# Altium schematic sheet 11_Temp1.SchDoc: Misc
size A3; Organization: Lime Microsystems; Address1: Surrey Tech Centre; Address2: Guildford GU2 7YG; Address3: Surrey; Address4: United Kingdom; Revision: v1.1; SheetNumber: 10; SheetTotal: 10
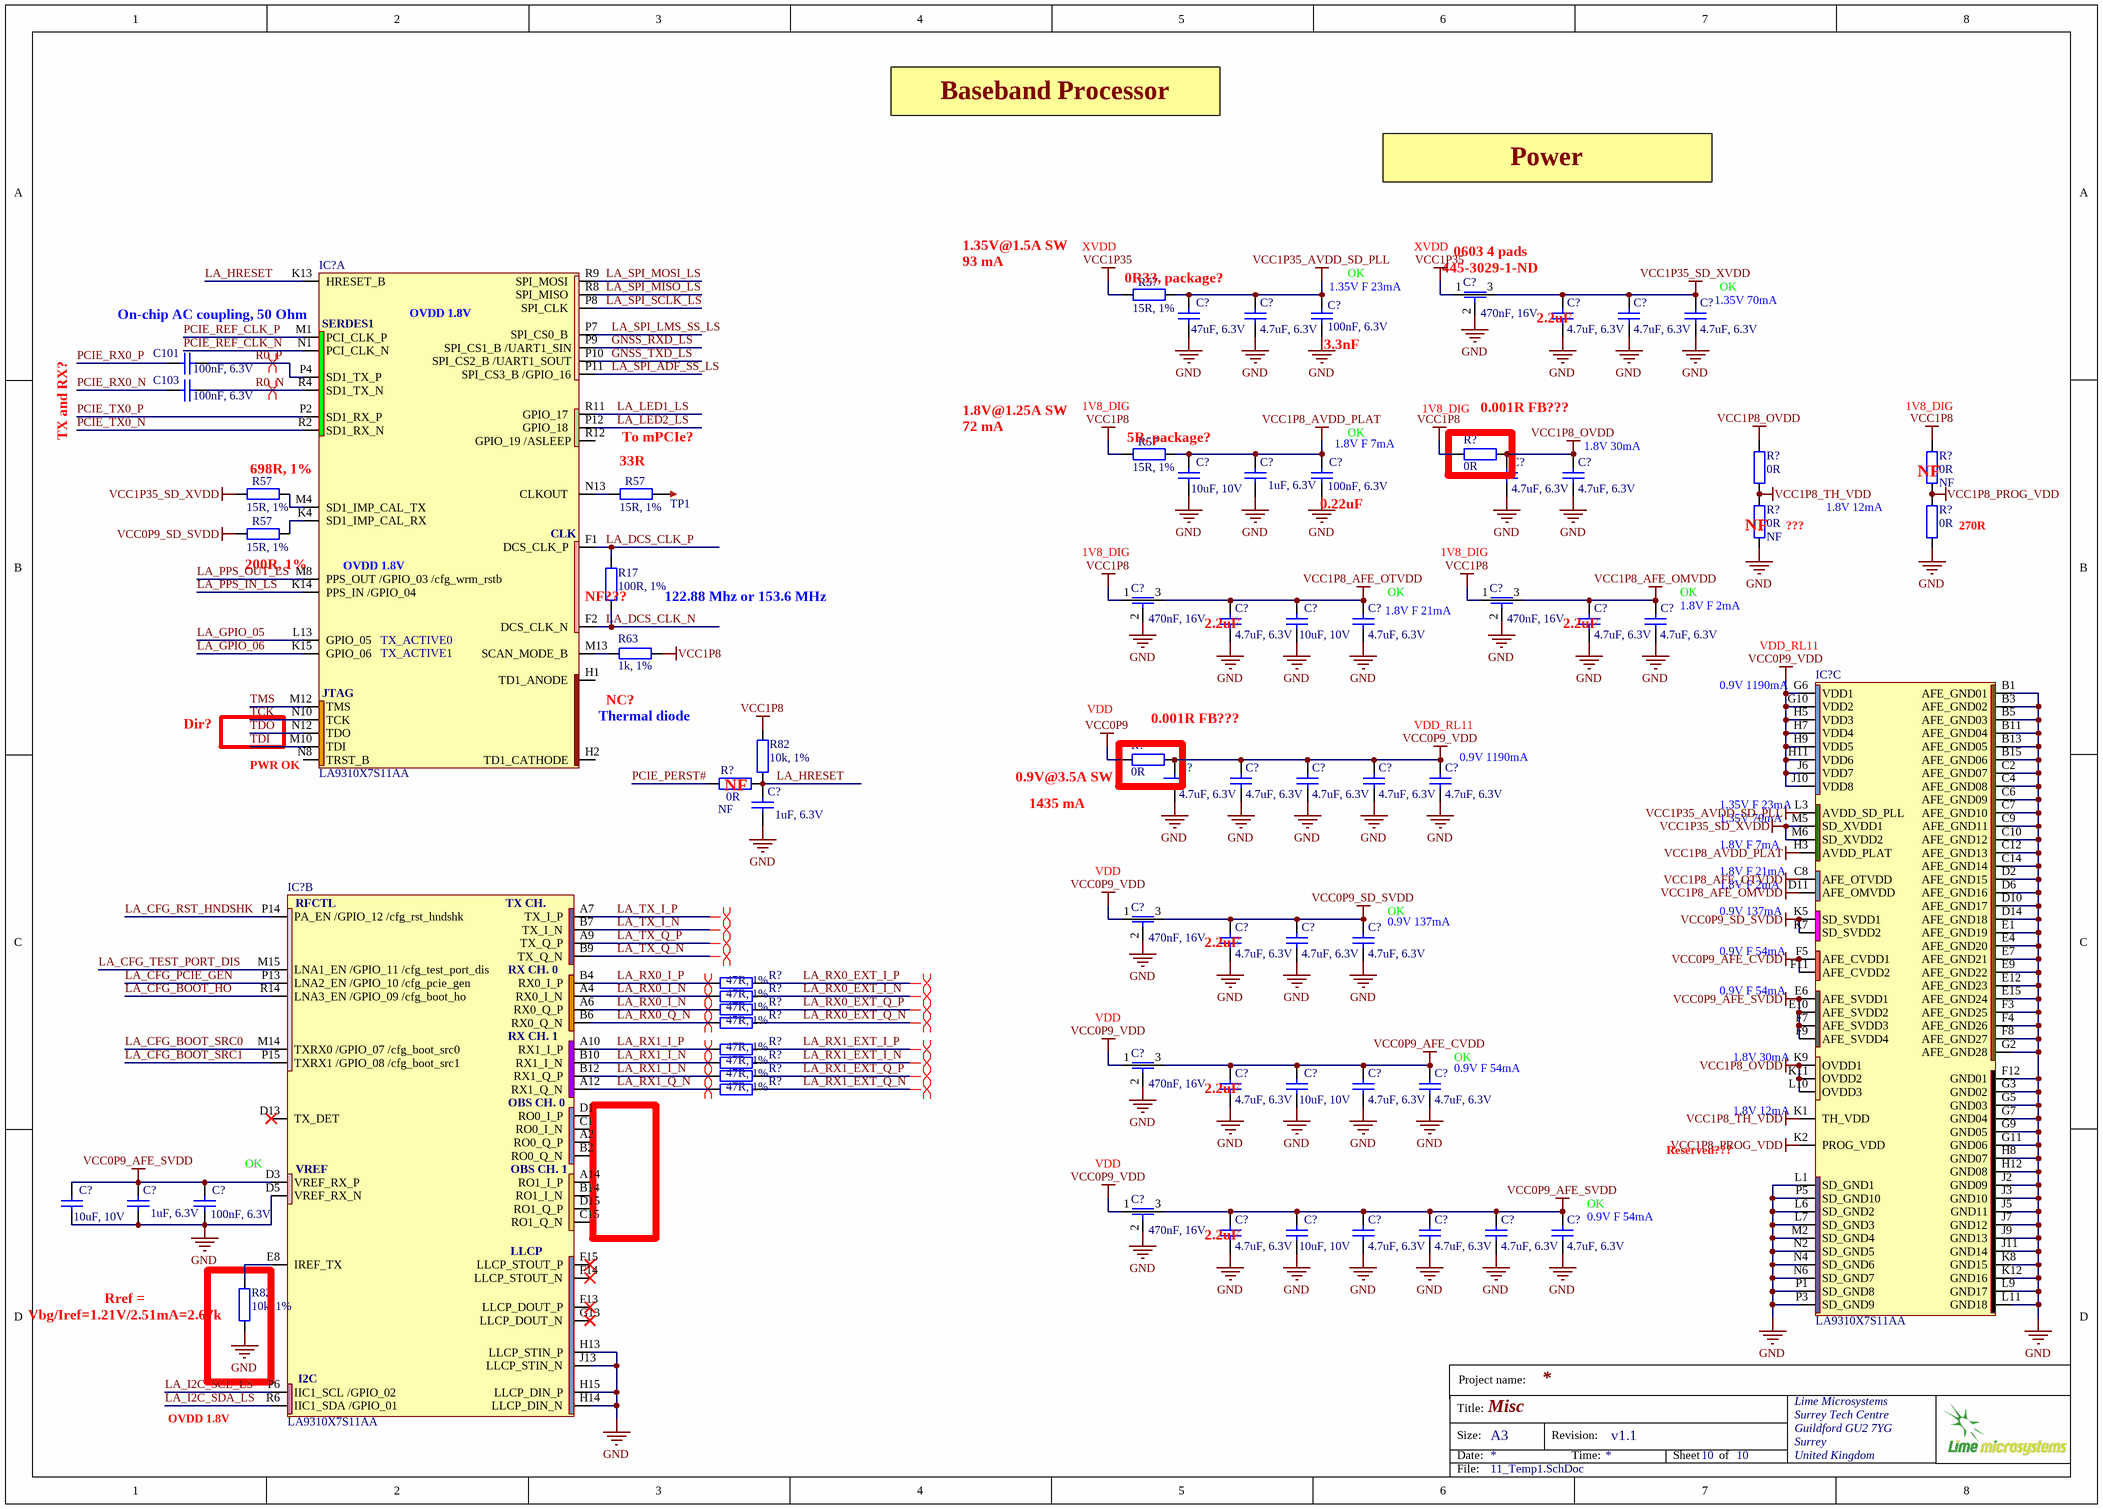
[diagram p0: 11_Temp1.SchDoc]

## Parts
(Parts that share a designator on the sheet are numbered #1, #2 ... from top to bottom, then left to right.)
C101  100nF, 6.3V  [CAP0201]
C103  100nF, 6.3V  [CAP0201]
C?#1  470nF, 16V  [CAP0805_FEEDTHROUGH]
C?#2  47uF, 6.3V  [CAP0603]
C?#3  4.7uF, 6.3V  [CAP0402]
C?#4  100nF, 6.3V  [CAP0201]
C?#5  4.7uF, 6.3V  [CAP0402]
C?#6  4.7uF, 6.3V  [CAP0402]
C?#7  4.7uF, 6.3V  [CAP0402]
C?#8  10uF, 10V  [CAP0603]
C?#9  1uF, 6.3V  [CAP0201]
C?#10  100nF, 6.3V  [CAP0201]
C?#11  4.7uF, 6.3V  [CAP0402]
C?#12  4.7uF, 6.3V  [CAP0402]
C?#13  470nF, 16V  [CAP0805_FEEDTHROUGH]
C?#14  470nF, 16V  [CAP0805_FEEDTHROUGH]
C?#15  4.7uF, 6.3V  [CAP0402]
C?#16  10uF, 10V  [CAP0603]
C?#17  4.7uF, 6.3V  [CAP0402]
C?#18  4.7uF, 6.3V  [CAP0402]
C?#19  4.7uF, 6.3V  [CAP0402]
C?#20  4.7uF, 6.3V  [CAP0402]
C?#21  4.7uF, 6.3V  [CAP0402]
C?#22  4.7uF, 6.3V  [CAP0402]
C?#23  4.7uF, 6.3V  [CAP0402]
C?#24  4.7uF, 6.3V  [CAP0402]
C?#25  1uF, 6.3V  [CAP0201]
C?#26  470nF, 16V  [CAP0805_FEEDTHROUGH]
C?#27  4.7uF, 6.3V  [CAP0402]
C?#28  4.7uF, 6.3V  [CAP0402]
C?#29  4.7uF, 6.3V  [CAP0402]
C?#30  470nF, 16V  [CAP0805_FEEDTHROUGH]
C?#31  4.7uF, 6.3V  [CAP0402]
C?#32  10uF, 10V  [CAP0603]
C?#33  4.7uF, 6.3V  [CAP0402]
C?#34  4.7uF, 6.3V  [CAP0402]
C?#35  10uF, 10V  [CAP0603]
C?#36  1uF, 6.3V  [CAP0201]
C?#37  100nF, 6.3V  [CAP0201]
C?#38  470nF, 16V  [CAP0805_FEEDTHROUGH]
C?#39  4.7uF, 6.3V  [CAP0402]
C?#40  10uF, 10V  [CAP0603]
C?#41  4.7uF, 6.3V  [CAP0402]
C?#42  4.7uF, 6.3V  [CAP0402]
C?#43  4.7uF, 6.3V  [CAP0402]
C?#44  4.7uF, 6.3V  [CAP0402]
IC?#1  LA9310X7S11AA  [LA9310X7S11AA]  (part A of 3)
IC?#2  LA9310X7S11AA  [LA9310X7S11AA]  (part C of 3)
IC?#3  LA9310X7S11AA  [LA9310X7S11AA]  (part B of 3)
R17  100R, 1%  [RES0201]
R57#1  15R, 1%  [RES0201]
R57#2  15R, 1%  [RES0201]
R57#3  15R, 1%  [RES0201]
R57#4  15R, 1%  [RES0201]
R57#5  15R, 1%  [RES0201]
R63  1k, 1%  [RES0201]
R82#1  10k, 1%  [RES0201]
R82#2  10k, 1%  [RES0201]
R?#1  0R  [RES0201]
R?#2  0R  [RES0201]
R?#3  0R  Assembly Info: NF  [RES0201]
R?#4  0R  Assembly Info: NF  [RES0201]
R?#5  0R  [RES0201]
R?#6  0R  [RES0201]
R?#7  0R  Assembly Info: NF  [RES0201]
R?#8  47R, 1%  [RES0201]
R?#9  47R, 1%  [RES0201]
R?#10  47R, 1%  [RES0201]
R?#11  47R, 1%  [RES0201]
R?#12  47R, 1%  [RES0201]
R?#13  47R, 1%  [RES0201]
R?#14  47R, 1%  [RES0201]
R?#15  47R, 1%  [RES0201]
TP1  TESTPOINT_PAD  [TP_PAD_1MM]  (value not drawn)  (no BOM)

## Nets
GND: C?#1.2 C?#2.1 C?#3.1 C?#4.2 C?#5.1 C?#6.1 C?#7.1 C?#8.1 C?#9.2 C?#10.2 C?#11.1 C?#12.1 C?#13.2 C?#14.2 C?#15.1 C?#16.1 C?#17.1 C?#18.1 C?#19.1 C?#20.1 C?#21.1 C?#22.1 C?#23.1 C?#24.1 C?#25.2 C?#26.2 C?#27.1 C?#28.1 C?#29.1 C?#30.2 C?#31.1 C?#32.1 C?#33.1 C?#34.1 C?#35.1 C?#36.2 C?#37.2 C?#38.2 C?#39.1 C?#40.1 C?#41.1 C?#42.1 C?#43.1 C?#44.1 IC?#2.B1(AFE_GND01) IC?#2.B3(AFE_GND02) IC?#2.B5(AFE_GND03) IC?#2.B11(AFE_GND04) IC?#2.B13(AFE_GND05) IC?#2.B15(AFE_GND06) IC?#2.C2(AFE_GND07) IC?#2.C4(AFE_GND08) IC?#2.C6(AFE_GND09) IC?#2.C7(AFE_GND10) IC?#2.C9(AFE_GND11) IC?#2.C10(AFE_GND12) IC?#2.C12(AFE_GND13) IC?#2.C14(AFE_GND14) IC?#2.D2(AFE_GND15) IC?#2.D6(AFE_GND16) IC?#2.D10(AFE_GND17) IC?#2.D14(AFE_GND18) IC?#2.E1(AFE_GND19) IC?#2.E4(AFE_GND20) IC?#2.E7(AFE_GND21) IC?#2.E9(AFE_GND22) IC?#2.E12(AFE_GND23) IC?#2.E15(AFE_GND24) IC?#2.F3(AFE_GND25) IC?#2.F4(AFE_GND26) IC?#2.F8(AFE_GND27) IC?#2.F12(GND01) IC?#2.G2(AFE_GND28) IC?#2.G3(GND02) IC?#2.G5(GND03) IC?#2.G7(GND04) IC?#2.G9(GND05) IC?#2.G11(GND06) IC?#2.H8(GND07) IC?#2.H12(GND08) IC?#2.J2(GND09) IC?#2.J3(GND10) IC?#2.J5(GND11) IC?#2.J7(GND12) IC?#2.J9(GND13) IC?#2.J11(GND14) IC?#2.K8(GND15) IC?#2.K12(GND16) IC?#2.L1(SD_GND1) IC?#2.L6(SD_GND2) IC?#2.L7(SD_GND3) IC?#2.L9(GND17) IC?#2.L11(GND18) IC?#2.M2(SD_GND4) IC?#2.N2(SD_GND5) IC?#2.N4(SD_GND6) IC?#2.N6(SD_GND7) IC?#2.P1(SD_GND8) IC?#2.P3(SD_GND9) IC?#2.P5(SD_GND10) IC?#3.D5(VREF_RX_N) IC?#3.H13(LLCP_STIN_P) IC?#3.H14(LLCP_DIN_N) IC?#3.H15(LLCP_DIN_P) IC?#3.J13(LLCP_STIN_N) R82#2.2 R?#4.1 R?#5.1
VCC0P9: R?#6.2
VCC0P9_AFE_CVDD: C?#30.3 C?#31.2 C?#32.2 C?#33.2 C?#34.2 IC?#2.F5(AFE_CVDD1) IC?#2.F11(AFE_CVDD2)
VCC0P9_AFE_SVDD: C?#35.2 C?#36.1 C?#37.1 C?#38.3 C?#39.2 C?#40.2 C?#41.2 C?#42.2 C?#43.2 C?#44.2 IC?#2.E6(AFE_SVDD1) IC?#2.E10(AFE_SVDD2) IC?#2.F7(AFE_SVDD3) IC?#2.F9(AFE_SVDD4) IC?#3.D3(VREF_RX_P)
VCC0P9_SD_SVDD: C?#26.3 C?#27.2 C?#28.2 C?#29.2 IC?#2.K5(SD_SVDD1) IC?#2.K7(SD_SVDD2) R57#5.2
VCC0P9_VDD: C?#20.2 C?#21.2 C?#22.2 C?#23.2 C?#24.2 C?#26.1 C?#30.1 C?#38.1 IC?#2.G6(VDD1) IC?#2.G10(VDD2) IC?#2.H5(VDD3) IC?#2.H7(VDD4) IC?#2.H9(VDD5) IC?#2.H11(VDD6) IC?#2.J6(VDD7) IC?#2.J10(VDD8) R?#6.1
VCC1P8: C?#13.1 C?#14.1 R57#2.2 R63.2 R82#1.1 R?#1.2 R?#3.2
VCC1P8_AFE_OMVDD: C?#14.3 C?#18.2 C?#19.2 IC?#2.D11(AFE_OMVDD)
VCC1P8_AFE_OTVDD: C?#13.3 C?#15.2 C?#16.2 C?#17.2 IC?#2.C8(AFE_OTVDD)
VCC1P8_AVDD_PLAT: C?#8.2 C?#9.1 C?#10.1 IC?#2.H3(AVDD_PLAT) R57#2.1
VCC1P8_OVDD: C?#11.2 C?#12.2 IC?#2.K9(OVDD1) IC?#2.K11(OVDD2) IC?#2.L10(OVDD3) R?#1.1 R?#2.2
VCC1P8_PROG_VDD: IC?#2.K2(PROG_VDD) R?#3.1 R?#5.2
VCC1P8_TH_VDD: IC?#2.K1(TH_VDD) R?#2.1 R?#4.2
VCC1P35: C?#1.1 R57#1.2
VCC1P35_AVDD_SD_PLL: C?#2.2 C?#3.2 C?#4.1 IC?#2.L3(AVDD_SD_PLL) R57#1.1
VCC1P35_SD_XVDD: C?#1.3 C?#5.2 C?#6.2 C?#7.2 IC?#2.M5(SD_XVDD1) IC?#2.M6(SD_XVDD2) R57#3.2
GNSS_RXD_LS: IC?#1.P9(SPI_CS1_B_/UART1_SIN)
GNSS_TXD_LS: IC?#1.P10(SPI_CS2_B_/UART1_SOUT)
LA_CFG_BOOT_HO: IC?#3.R14(LNA3_EN_/GPIO_09_/cfg_boot_ho)
LA_CFG_BOOT_SRC0: IC?#3.M14(TXRX0_/GPIO_07_/cfg_boot_src0)
LA_CFG_BOOT_SRC1: IC?#3.P15(TXRX1_/GPIO_08_/cfg_boot_src1)
LA_CFG_PCIE_GEN: IC?#3.P13(LNA2_EN_/GPIO_10_/cfg_pcie_gen)
LA_CFG_RST_HNDSHK: IC?#3.P14(PA_EN_/GPIO_12_/cfg_rst_hndshk)
LA_CFG_TEST_PORT_DIS: IC?#3.M15(LNA1_EN_/GPIO_11_/cfg_test_port_dis)
LA_DCS_CLK_N: IC?#1.F2(DCS_CLK_N) R17.1
LA_DCS_CLK_P: IC?#1.F1(DCS_CLK_P) R17.2
LA_GPIO_05: IC?#1.L13(GPIO_05)
LA_GPIO_06: IC?#1.K15(GPIO_06)
LA_HRESET: C?#25.1 IC?#1.K13(HRESET_B) R82#1.2 R?#7.2
LA_I2C_SCL_LS: IC?#3.P6(IIC1_SCL_/GPIO_02)
LA_I2C_SDA_LS: IC?#3.R6(IIC1_SDA_/GPIO_01)
LA_LED1_LS: IC?#1.R11(GPIO_17)
LA_LED2_LS: IC?#1.P12(GPIO_18)
LA_PPS_IN_LS: IC?#1.K14(PPS_IN_/GPIO_04)
LA_PPS_OUT_LS: IC?#1.M8(PPS_OUT_/GPIO_03_/cfg_wrm_rstb)
LA_RX0_EXT_I_N: R?#9.2
LA_RX0_EXT_I_P: R?#8.2
LA_RX0_EXT_Q_N: R?#11.2
LA_RX0_EXT_Q_P: R?#10.2
LA_RX0_I_N: IC?#3.A4(RX0_I_N) IC?#3.A6(RX0_Q_P) R?#9.1 R?#10.1
LA_RX0_I_P: IC?#3.B4(RX0_I_P) R?#8.1
LA_RX0_Q_N: IC?#3.B6(RX0_Q_N) R?#11.1
LA_RX1_EXT_I_N: R?#13.2
LA_RX1_EXT_I_P: R?#12.2
LA_RX1_EXT_Q_N: R?#15.2
LA_RX1_EXT_Q_P: R?#14.2
LA_RX1_I_N: IC?#3.B10(RX1_I_N) IC?#3.B12(RX1_Q_P) R?#13.1 R?#14.1
LA_RX1_I_P: IC?#3.A10(RX1_I_P) R?#12.1
LA_RX1_Q_N: IC?#3.A12(RX1_Q_N) R?#15.1
LA_SPI_ADF_SS_LS: IC?#1.P11(SPI_CS3_B_/GPIO_16)
LA_SPI_LMS_SS_LS: IC?#1.P7(SPI_CS0_B)
LA_SPI_MISO_LS: IC?#1.R8(SPI_MISO)
LA_SPI_MOSI_LS: IC?#1.R9(SPI_MOSI)
LA_SPI_SCLK_LS: IC?#1.P8(SPI_CLK)
LA_TX_I_N: IC?#3.B7(TX_I_N)
LA_TX_I_P: IC?#3.A7(TX_I_P)
LA_TX_Q_N: IC?#3.B9(TX_Q_N)
LA_TX_Q_P: IC?#3.A9(TX_Q_P)
PCIE_PERST#: R?#7.1
PCIE_REF_CLK_N: IC?#1.N1(PCI_CLK_N)
PCIE_REF_CLK_P: IC?#1.M1(PCI_CLK_P)
PCIE_RX0_N: C103.1
PCIE_RX0_P: C101.1
PCIE_TX0_N: IC?#1.R2(SD1_RX_N)
PCIE_TX0_P: IC?#1.P2(SD1_RX_P)
R0_N: C103.2 IC?#1.R4(SD1_TX_N)
R0_P: C101.2 IC?#1.P4(SD1_TX_P)
TCK: IC?#1.N10(TCK)
TDI: IC?#1.M10(TDI)
TDO: IC?#1.N12(TDO)
TMS: IC?#1.M12(TMS)
NetIC?#1_K4: IC?#1.K4(SD1_IMP_CAL_RX) R57#5.1
NetIC?#1_M4: IC?#1.M4(SD1_IMP_CAL_TX) R57#3.1
NetIC?#1_M13: IC?#1.M13(SCAN_MODE_B) R63.1
NetIC?#1_N13: IC?#1.N13(CLKOUT) R57#4.2
NetIC?#3_E8: IC?#3.E8(IREF_TX) R82#2.1
NetR57#4_1: R57#4.1 TP1.1

Not connected (* = marked no-connect by the designer): IC?#1 H1(TD1_ANODE_) H2(TD1_CATHODE_) N8(TRST_B_) R12(GPIO_19_/ASLEEP); IC?#3 A2(RO0_Q_P_) A14(RO1_I_P_) B2(RO0_Q_N_) B14(RO1_I_N_) C1(RO0_I_N_) C15(RO1_Q_N_) D1(RO0_I_P_) D13(TX_DET_)* D15(RO1_Q_P_) F13(LLCP_DOUT_P_)* F14(LLCP_STOUT_N_)* F15(LLCP_STOUT_P_)* G13(LLCP_DOUT_N_)*

## Layout directives
differential pair: LA_RX0_EXT_I_N, LA_RX0_EXT_I_P, LA_RX0_EXT_Q_N, LA_RX0_EXT_Q_P, LA_RX0_I_N, LA_RX0_I_P, LA_RX0_Q_N, LA_RX1_EXT_I_N, LA_RX1_EXT_I_P, LA_RX1_EXT_Q_N, LA_RX1_EXT_Q_P, LA_RX1_I_N, LA_RX1_I_P, LA_RX1_Q_N, LA_TX_I_N, LA_TX_I_P, LA_TX_Q_N, LA_TX_Q_P, R0_N, R0_P

## Notes on the sheet
- Baseband Processor
- Power
- 1.35V@1.5A SW
- (near R57#1) XVDD
- (near C?#1) XVDD
- (near IC?#1) OVDD 1.8V
- 93 mA
- (near R57#1) 0R33, package?
- (near C?#4) 1.35V F 23mA
- (near C?#4) OK
- (near C?#1) 0603 4 pads 445-3029-1-ND
- (near C?#7) 1.35V 70mA
- (near C?#7) OK
- (near IC?#1) On-chip AC coupling, 50 Ohm
- (near C?#4) 3.3nF
- (near C?#5) 2.2uF
- TX and RX?
- To mPCIe?
- 1.8V@1.25A SW
- 72 mA
- (near R57#2) 1V8_DIG
- (near R57#2) 5R, package?
- (near C?#10) 1.8V F 7mA
- (near C?#10) OK
- (near R?#1) 1V8_DIG
- 0.001R FB???
- (near C?#12) 1.8V 30mA
- (near R?#3) 1V8_DIG
- 698R, 1%
- 33R
- (near C?#10) 0.22uF
- (near R?#5) 1.8V 12mA
- (near R?#3) NF
- 200R, 1%
- (near C?#13) 1V8_DIG
- (near C?#14) 1V8_DIG
- (near R?#4) NF
- (near R?#4) ???
- (near R?#5) 270R
- (near R17) NF???
- 122.88 Mhz or 153.6 MHz
- (near C?#15) 2.2uF
- (near C?#17) 1.8V F 21mA
- (near C?#17) OK
- (near C?#18) 2.2uF
- (near C?#19) 1.8V F 2mA
- (near C?#19) OK
- (near IC?#2) VDD_RL11
- (near IC?#1) Thermal diode
- NC?
- (near R?#6) VDD
- (near IC?#2) 0.9V 1190mA
- Dir?
- (near IC?#1) PWR OK
- NF
- (near R?#6) 0.9V@3.5A SW
- (near C?#24) VDD_RL11
- (near C?#24) 0.9V 1190mA
- 1435 mA
- (near IC?#2) 1.8V F 7mA
- (near IC?#2) 1.35V F 23mA
- (near IC?#2) 1.35V 70mA
- (near C?#26) VDD
- (near C?#29) 0.9V 137mA
- (near C?#29) OK
- (near IC?#2) 0.9V 137mA
- (near IC?#2) 1.8V F 21mA
- (near IC?#2) 1.8V F 2mA
- (near C?#27) 2.2uF
- (near IC?#2) 0.9V F 54mA
- (near C?#30) VDD
- (near C?#31) 2.2uF
- (near C?#34) 0.9V F 54mA
- (near C?#34) OK
- (near IC?#2) 1.8V 30mA
- (near IC?#2) 1.8V 12mA
- OK
- (near C?#38) VDD
- Reserved???
- (near C?#39) 2.2uF
- (near C?#44) 0.9V F 54mA
- (near C?#44) OK
- (near R82#2) Rref = Vbg/Iref=1.21V/2.51mA=2.67k
- OVDD 1.8V
- Project name:
- Title:
- Size:
- Date:
- A3
- Revision:
- Time:
- Sheet
- of
- File:
- (in symbol LA9310X7S11AA, part A) SERDES1; CLK; TX_ACTIVE0; TX_ACTIVE1; JTAG
- (in symbol LA9310X7S11AA, part B) RFCTL; TX CH.; RX CH. 0; RX CH. 1; OBS CH. 0; VREF; OBS CH. 1; LLCP; I2C

## Library data of the parts
C101 C103 C?#4 C?#10 C?#37 = Cap_0402: Part Description: 100 pF ±5% 50V Ceramic Capacitor C0G, NP0 0201 (0603 Metric); Manufacturer: Samsung; Manufacturer Part Number 1: CL03A104MP3NNNC; Tolerance: 20%; Voltage Rating (DC): 10V; Value: 100nF, 6.3V; Capacitance: 100nF; Case/Package: 0201; Case Code (Imperial): 0201; Case Code (Metric): 0603; ComponentLink5Description: https://datasheet.ciiva.com/25788/cl03a104mp3nnnc-25788272.pdf?src-supplier=Digi-Key; ComponentLink5URL: https://datasheet.ciiva.com/25788/cl03a104mp3nnnc-25788272.pdf?src-supplier=Digi-Key; Length: 0.024inch; Max Operating Temperature: 85°C; Min Operating Temperature: -55°C; Mount: Surface Mount; Package Quantity: 1; Packaging: Tape and Reel; Pricing 1: 1=0,10000, 10=0,03000, 50=0,01640, 100=0,01330, 500=0,00950, 1000=0,00747, 2500=0,00679, 5000=0,00625 (USD); RoHS: Yes; RoHS Compliant: Yes; Series: CL; Stock 1: 3817176; Supplier 1: Digi-Key; Supplier Part Number 1: 1276-1321-1-ND; Thickness: 0.013inch; Voltage Rating: 10V; Width: 0.012inch
C?#1 C?#13 C?#14 C?#26 C?#30 C?#38 = Cap_feed_through: Part Description: 0.47µF Feed Through Capacitor 16V 2A 30mOhm 0805 (2012 Metric), 3 PC Pad; Manufacturer: Murata; Manufacturer Part Number 1: NFM21PC474R1C3D; Max Current Rating: 2A; Tolerance: 20%; DC Resistance (DCR): 30mR; Insulation Resistance: 1GR; Value: 470nF, 16V; Supplier 1: Digi-Key; Supplier Part Number 1: 490-2537-1-ND; Stock 1: 220606; Pricing 1: 1=0,25000, 10=0,22900, 25=0,21840, 50=0,21160, 100=0,20450, 250=0,19392, 500=0,16218, 1000=0,12586 (USD); Mount: Surface Mount,PCB; Case/Package: 0805; Weight: 0.000194oz; Case Code (Metric): 2012; Case Code (Imperial): 0805; Min Operating Temperature: -55°C; Max Operating Temperature: 125°C; Package Quantity: 1; Capacitance: 470nF; Packaging: Tape and Reel; Max Voltage Rating (DC): 16V; Current Rating: 2A; Voltage Rating: 16V; Voltage Rating (DC): 16V; Voltage: 16V; Current: 2A; Termination: Flat; Length: 2mm; Height: 0.85mm; Width: 1.25mm; Depth: 1.25mm; Radiation Hardening: No; REACH SVHC: No SVHC; Lead Free: Lead Free; RoHS: Yes
C?#2 = Cap_0603: Part Description: 47 µF ±20% 6.3V Ceramic Capacitor X5R 0603 (1608 Metric); Manufacturer: Murata; Manufacturer Part Number 1: GRM188R60J476ME15D; Tolerance: 20%; Dielectric: X5R; Value: 47uF, 6.3V; Supplier 1: Digi-Key; Supplier Part Number 1: 490-13247-1-ND; Stock 1: 731453; Pricing 1: 1=0,45000, 10=0,31900, 50=0,24120, 100=0,21000, 500=0,15556, 1000=0,13223 (USD); RoHS: Yes; Mount: Surface Mount; Case/Package: 0603; Case Code (Metric): 1608; Case Code (Imperial): 0603; Min Operating Temperature: -55°C; Max Operating Temperature: 85°C; Packaging: Tape and Reel; Capacitance: 47uF; Voltage Rating: 6.3V; Voltage Rating (DC): 6.3V; Length: 0.063inch; Width: 0.031inch; Thickness: 0.039inch; RoHS Compliant: Yes; ComponentLink1URL: http://search.murata.co.jp/Ceramy/image/img/A01X/G101/ENG/GRM188R60J476ME15-01.pdf?src-supplier=Digi-Key; ComponentLink1Description: http://search.murata.co.jp/Ceramy/image/img/A01X/G101/ENG/GRM188R60J476ME15-01.pdf?src-supplier=Digi-Key; ComponentLink2URL: https://www.murata.com/~/media/webrenewal/support/library/catalog/products/capacitor/mlcc/c02e.ashx?la=en-us&src-supplier=Digi-Key; ComponentLink2Description: https://www.murata.com/~/media/webrenewal/support/library/catalog/products/capacitor/mlcc/c02e.ashx?la=en-us&src-supplier=Digi-Key
C?#3 C?#5-C?#7 C?#11 C?#12 C?#15 C?#17-C?#24 C?#27-C?#29 C?#31 C?#33 C?#34 C?#39 C?#41-C?#44 = Cap_0402: Manufacturer: Murata Electronics North America; Manufacturer Part Number 1: GRM155R60J475ME87D; Part Description: 4.7µF ±20% 6.3V X5R Ceramic Capacitor -55°C ~ 85°C Surface Mount, MLCC 0402 (1005 Metric) 0.039" L x 0.020" W (1.00mm x 0.50mm); Tolerance: ±20%; Capacitance: 4.7µF; Temperature Coefficient: X5R; Lead Style: -; Ratings: -; Height - Seated (Max): -; Thickness (Max): 0.022" (0.55mm); Voltage - Rated: 6.3V; Packaging: Cut Tape (CT); Lead Spacing: -; Category: Capacitors; Supplier Part Number 1: 490-5408-1-ND; Applications: General Purpose; Operating Temperature: -55°C ~ 85°C; Mounting Type: Surface Mount, MLCC; Features: Derating Recommended; RoHS: RoHS Compliant; Supplier 1: Digi-Key; Package / Case: 0402 (1005 Metric); Size / Dimension: 0.039" L x 0.020" W (1.00mm x 0.50mm); Value: 4.7uF, 6.3V
C?#8 C?#16 C?#32 C?#35 C?#40 = Cap_0603: Part Description: 10 µF ±20% 10V Ceramic Capacitor X5R 0603 (1608 Metric); Manufacturer: Murata; Manufacturer Part Number 1: GRM188R61A106ME69D; Dielectric: X5R; Material: Ceramic; Tolerance: 20%; Value: 10uF, 10V; ComponentLink1Description: http://search.murata.co.jp/Ceramy/image/img/A01X/G101/ENG/GRM188R61C106MAAL-01.pdf?src-supplier=Digi-Key; ComponentLink1URL: http://search.murata.co.jp/Ceramy/image/img/A01X/G101/ENG/GRM188R61C106MAAL-01.pdf?src-supplier=Digi-Key; ComponentLink2Description: https://search.murata.co.jp/Ceramy/image/img/A01X/G101/ENG/GRM188R61C106MAAL-01.pdf?src-supplier=Digi-Key; ComponentLink2URL: https://search.murata.co.jp/Ceramy/image/img/A01X/G101/ENG/GRM188R61C106MAAL-01.pdf?src-supplier=Digi-Key; ComponentLink3Description: http://search.murata.co.jp/Ceramy/image/img/A01X/partnumbering_e_01.pdf?src-supplier=Digi-Key; ComponentLink3URL: http://search.murata.co.jp/Ceramy/image/img/A01X/partnumbering_e_01.pdf?src-supplier=Digi-Key; Capacitance: 10uF; Case/Package: 0603; Case Code (Imperial): 0603; Case Code (Metric): 1608; ComponentLink4Description: http://www.farnell.com/datasheets/1872210.pdf?src-supplier=Farnell; ComponentLink4URL: http://www.farnell.com/datasheets/1872210.pdf?src-supplier=Farnell; ComponentLink5Description: http://www.mouser.com/ds/2/281/c02e-2905.pdf?src-supplier=Mouser; ComponentLink5URL: http://www.mouser.com/ds/2/281/c02e-2905.pdf?src-supplier=Mouser; ComponentLink6Description: http://www.farnell.com/datasheets/1872210.pdf?src-supplier=Newark; ComponentLink6URL: http://www.farnell.com/datasheets/1872210.pdf?src-supplier=Newark; ComponentLink7Description: http://www.farnell.com/datasheets/2048014.pdf?src-supplier=Element14; ComponentLink7URL: http://www.farnell.com/datasheets/2048014.pdf?src-supplier=Element14; ComponentLink8Description: http://www.farnell.com/datasheets/1872210.pdf?src-supplier=Element14; ComponentLink8URL: http://www.farnell.com/datasheets/1872210.pdf?src-supplier=Element14; ComponentLink9Description: http://search.murata.co.jp/Ceramy/image/img/A01X/G101/ENG/GRM188R61A106ME69-01.pdf?src-supplier=Digi-Key; ComponentLink9URL: http://search.murata.co.jp/Ceramy/image/img/A01X/G101/ENG/GRM188R61A106ME69-01.pdf?src-supplier=Digi-Key; Depth: 0.8mm; Height: 0.8mm; Lead Free: Lead Free; Length: 1.6mm; Max Operating Temperature: 85°C; Min Operating Temperature: -55°C; Mount: Surface Mount; Package Quantity: 4000; Packaging: Tape and Reel; Pricing 1: 1=0,16000, 10=0,11200, 50=0,06360, 100=0,05270, 500=0,03696, 1000=0,03060 (USD); RoHS: Yes; RoHS Compliant: Yes; Series: GRM; Stock 1: 820978; Supplier 1: Digi-Key; Supplier Part Number 1: 490-10475-1-ND; Termination: SMD/SMT; Thickness: 0.035inch; Voltage Rating (DC): 10V; Voltage Rating: 10V; Weight: 0.000222oz; Width: 0.8mm
C?#9 C?#25 C?#36 = Cap_0402: Manufacturer: TDK Corporation; Manufacturer Part Number 1: JMK063ABJ105MP-F; Part Description: 1µF ±20% 6.3V X5R Ceramic Capacitor -55°C ~ 85°C Surface Mount, MLCC 0201 (0603 Metric) 0.024" L x 0.012" W (0.60mm x 0.30mm); Value: 1uF, 20%; Tolerance: ±20%; Capacitance: 1.0µF; Temperature Coefficient: X5R; Supplier 1: Digi-Key; Supplier Part Number 1: 587-5864-2-ND; Applications: General Purpose; Features: -; Lead Style: -; Ratings: -; Thickness (Max): -; Lead Spacing: -; Height - Seated (Max): -; Size / Dimension: 0.024" L x 0.012" W (0.60mm x 0.30mm); Mounting Type: Surface Mount, MLCC; Operating Temperature: -55°C ~ 85°C; Package / Case: 0201 (0603 Metric); Packaging: Cut Tape (CT); Voltage - Rated: 6.3V; Category: Capacitors; RoHS: RoHS Compliant
IC?#1-IC?#3 = LA9310X7S11AA: Part Description: LFBGA157, low profile, fine-pitch ball grid array package, 157 terminals, 0.5 mm pitch, 8 mm x 8 mm x 1.25 mm body.; Manufacturer: NXP Semiconductors; Manufacturer Part Number 1: LA9310X7S11AA; Supplier 1: NXP Semiconductors; Supplier Part Number 1: LA9310X7S11AA
R17 = Res_0402: Manufacturer: Yageo; Manufacturer Part Number 1: RC0201FR-07100RL; Part Description: 100 Ohms ±1% 0.05W, 1/20W Chip Resistor 0201 (0603 Metric) Moisture Resistant Thick Film; Power Rating: 50mW; Voltage Rating: 25V; Temperature Coefficient: 200ppm/°C; ComponentLink1URL: http://www.yageo.com/documents/recent/PYu-RC_Group_51_RoHS_L_7.pdf; ComponentLink1Description: http://www.yageo.com/documents/recent/PYu-RC_Group_51_RoHS_L_7.pdf; Value: 100R, 1%; Supplier 1: Digi-Key; Supplier Part Number 1: 311-100MCT-ND; Stock 1: 1625377; Pricing 1: 1=0,10000, 10=0,03700, 100=0,01530, 1000=0,00685, 2500=0,00595, 5000=0,00491 (USD); RoHS: Yes; Case/Package: 0201; Case Code (Metric): 0603; Case Code (Imperial): 0201; Contact Plating: Tin,Matte; Size Code: 0201; Min Operating Temperature: -55°C; Max Operating Temperature: 125°C; Resistance: 100R; Tolerance: 1%; Packaging: Cut Tape; Package Quantity: 1; Resistor Type: Thick Film; Number of Terminations: 2; Termination: SMD/SMT; Max Power Dissipation: 50mW; Features: Moisture Resistant; Series: RC; Resistance Tolerance: 1%; Length: 0.024inch; Width: 0.012inch; Height: 0.01inch; Radiation Hardening: No; Lead Free: Lead Free; RoHS Compliant: Yes; ComponentLink2URL: https://datasheet.ciiva.com/2560/pyu-r-int-thick-7-2560866.pdf?src-supplier=Digi-Key; ComponentLink2Description: https://datasheet.ciiva.com/2560/pyu-r-int-thick-7-2560866.pdf?src-supplier=Digi-Key; ComponentLink3URL: https://datasheet.ciiva.com/2560/pyu-r-int-thick-7-2560867.pdf?src-supplier=Digi-Key; ComponentLink3Description: https://datasheet.ciiva.com/2560/pyu-r-int-thick-7-2560867.pdf?src-supplier=Digi-Key; ComponentLink4URL: https://datasheet.ciiva.com/2560/pyu-r-int-thick-7-2560865.pdf?src-supplier=Digi-Key; ComponentLink4Description: https://datasheet.ciiva.com/2560/pyu-r-int-thick-7-2560865.pdf?src-supplier=Digi-Key; ComponentLink5URL: https://datasheet.ciiva.com/8887/pyu-rc0201-51-rohs-l-8-8887865.pdf?src-supplier=Avnet; ComponentLink5Description: https://datasheet.ciiva.com/8887/pyu-rc0201-51-rohs-l-8-8887865.pdf?src-supplier=Avnet
R57#1-R57#5 = Res_0402: Manufacturer: Yageo; Manufacturer Part Number 1: RC0201FR-0715RL; Part Description: 15 Ohms ±1% 0.05W, 1/20W Chip Resistor 0201 (0603 Metric) Moisture Resistant Thick Film; Power Rating: 50mW; Voltage Rating: 25V; Temperature Coefficient: 200ppm/°C; Value: 15R, 1%; ComponentLink1URL: https://datasheet.ciiva.com/5924/1563626-5924912.pdf?src-supplier=Farnell; ComponentLink1Description: https://datasheet.ciiva.com/5924/1563626-5924912.pdf?src-supplier=Farnell; ComponentLink2URL: https://datasheet.ciiva.com/22661/1563626-22661319.pdf?src-supplier=Element14; ComponentLink2Description: https://datasheet.ciiva.com/22661/1563626-22661319.pdf?src-supplier=Element14; Supplier 1: Digi-Key; Supplier Part Number 1: 311-15.0MCT-ND; Stock 1: 379739; Pricing 1: 1=0,10000, 10=0,03700, 100=0,01530, 1000=0,00685, 2500=0,00595, 5000=0,00491 (USD); RoHS: Yes; Case/Package: 0201; Case Code (Imperial): 0201; Case Code (Metric): 0603; Size Code: 0201; Min Operating Temperature: -55°C; Max Operating Temperature: 125°C; Resistance: 15R; Tolerance: 1%; Packaging: Cut Tape; Package Quantity: 1; Termination: SMD/SMT; Resistor Type: Thick Film; Number of Terminations: 2; Max Power Dissipation: 50mW; Features: Moisture Resistant; Series: RC; Resistance Tolerance: 1%; Length: 0.6mm; Width: 0.3mm; Height: 0.23mm; Lead Free: Lead Free; RoHS Compliant: Yes; ComponentLink3URL: https://datasheet.ciiva.com/7672/1563626-7672202.pdf?src-supplier=Element14; ComponentLink3Description: https://datasheet.ciiva.com/7672/1563626-7672202.pdf?src-supplier=Element14; ComponentLink4URL: https://datasheet.ciiva.com/2493/pyu-r-int-thick-7-2493785.pdf?src-supplier=Digi-Key; ComponentLink4Description: https://datasheet.ciiva.com/2493/pyu-r-int-thick-7-2493785.pdf?src-supplier=Digi-Key; ComponentLink5URL: https://datasheet.ciiva.com/2493/pyu-r-int-thick-7-2493786.pdf?src-supplier=Digi-Key; ComponentLink5Description: https://datasheet.ciiva.com/2493/pyu-r-int-thick-7-2493786.pdf?src-supplier=Digi-Key; ComponentLink6URL: https://datasheet.ciiva.com/2493/pyu-r-int-thick-7-2493784.pdf?src-supplier=Digi-Key; ComponentLink6Description: https://datasheet.ciiva.com/2493/pyu-r-int-thick-7-2493784.pdf?src-supplier=Digi-Key
R63 = Res_0402: Manufacturer: Yageo; Manufacturer Part Number 1: RC0201FR-071KL; Part Description: 1 kOhms ±1% 0.05W, 1/20W Chip Resistor 0201 (0603 Metric) Moisture Resistant Thick Film; Resistance: 1kR; Power Rating: 50mW; Voltage Rating: 25V; Temperature Coefficient: 200ppm/°C; Value: 1k, 1%; Supplier 1: Digi-Key; Supplier Part Number 1: 311-1KMDKR-ND; Stock 1: 9099863; Pricing 1: 1=0,10000, 10=0,03700, 100=0,01530, 1000=0,00685, 2500=0,00595, 5000=0,00491 (USD); RoHS: Yes; Case/Package: 0201; Case Code (Metric): 0603; Case Code (Imperial): 0201; Contact Plating: Tin,Matte; Min Operating Temperature: -55°C; Max Operating Temperature: 125°C; Package Quantity: 10000; Packaging: Tape and Reel; Tolerance: 1%; Resistor Type: Thick Film; Number of Terminations: 2; Termination: SMD/SMT; Max Power Dissipation: 50mW; Working Voltage: 25V; Features: Moisture Resistant; Series: RC; Resistance Tolerance: 1%; Technology: THICK FILM; Construction: Rectangular; Length: 0.024inch; Width: 0.012inch; Height: 0.01inch; Depth: 0.3mm; Radiation Hardening: No; Military Standard: Not; Lead Free: Lead Free; RoHS Compliant: Yes; ComponentLink1URL: https://datasheet.ciiva.com/7672/1563626-7672204.pdf?src-supplier=Element14; ComponentLink1Description: https://datasheet.ciiva.com/7672/1563626-7672204.pdf?src-supplier=Element14; ComponentLink2URL: https://datasheet.ciiva.com/22698/1563626-22698505.pdf?src-supplier=Element14; ComponentLink2Description: https://datasheet.ciiva.com/22698/1563626-22698505.pdf?src-supplier=Element14; ComponentLink3URL: https://datasheet.ciiva.com/29721/pyu-r-int-thick-7-29721196.pdf?src-supplier=Digi-Key; ComponentLink3Description: https://datasheet.ciiva.com/29721/pyu-r-int-thick-7-29721196.pdf?src-supplier=Digi-Key; ComponentLink4URL: https://datasheet.ciiva.com/29721/pyu-r-int-thick-7-29721195.pdf?src-supplier=Digi-Key; ComponentLink4Description: https://datasheet.ciiva.com/29721/pyu-r-int-thick-7-29721195.pdf?src-supplier=Digi-Key; ComponentLink5URL: https://datasheet.ciiva.com/8896/pyu-rc0201-51-rohs-l-8-8896174.pdf?src-supplier=Avnet; ComponentLink5Description: https://datasheet.ciiva.com/8896/pyu-rc0201-51-rohs-l-8-8896174.pdf?src-supplier=Avnet
R82#1 R82#2 = Res_0402: Manufacturer: Yageo; Manufacturer Part Number 1: RC0201FR-0710KL; Part Description: 10 kOhms ±1% 0.05W, 1/20W Chip Resistor 0201 (0603 Metric) Moisture Resistant Thick Film; Resistance: 10kR; Power Rating: 50mW; Voltage Rating: 25V; Temperature Coefficient: 200ppm/°C; Value: 10k, 1%; ComponentLink1URL: https://datasheet.ciiva.com/5924/1563626-5924912.pdf?src-supplier=Farnell; ComponentLink1Description: https://datasheet.ciiva.com/5924/1563626-5924912.pdf?src-supplier=Farnell; ComponentLink2URL: https://datasheet.ciiva.com/22661/1563626-22661319.pdf?src-supplier=Element14; ComponentLink2Description: https://datasheet.ciiva.com/22661/1563626-22661319.pdf?src-supplier=Element14; Supplier 1: Digi-Key; Supplier Part Number 1: 311-10.0KMCT-ND; Stock 1: 17142315; Pricing 1: 1=0,10000, 10=0,03700, 100=0,01530, 1000=0,00685, 2500=0,00595, 5000=0,00491 (USD); RoHS: Yes; Case/Package: 0201; Number of Pins: 2; Case Code (Imperial): 0201; Case Code (Metric): 0603; Contact Plating: Tin,Matte; Weight: 6E-06oz; Min Operating Temperature: -55°C; Max Operating Temperature: 125°C; Tolerance: 1%; Packaging: Tape and Reel; Package Quantity: 10000; Termination: SMD/SMT; Resistor Type: Thick Film; Number of Terminations: 2; Max Power Dissipation: 50mW; Voltage Rating (DC): 25V; Features: Moisture Resistant; Series: RC; Resistance Tolerance: 1%; Construction: Rectangular; Working Voltage: 25V; Technology: THICK FILM; Length: 0.6mm; Width: 0.012inch; Height: 0.01inch; Depth: 0.3mm; Radiation Hardening: No; Reach SVHC Compliant: Yes; Military Standard: Not; Lead Free: Lead Free; RoHS Compliant: Yes; ComponentLink3URL: https://datasheet.ciiva.com/7660/1421516-7660807.pdf?src-supplier=Element14; ComponentLink3Description: https://datasheet.ciiva.com/7660/1421516-7660807.pdf?src-supplier=Element14; ComponentLink4URL: https://datasheet.ciiva.com/46391/1421516-46391339.pdf?src-supplier=Element14; ComponentLink4Description: https://datasheet.ciiva.com/46391/1421516-46391339.pdf?src-supplier=Element14; ComponentLink5URL: https://datasheet.ciiva.com/2467/pyu-r-int-thick-7-2467110.pdf?src-supplier=Digi-Key; ComponentLink5Description: https://datasheet.ciiva.com/2467/pyu-r-int-thick-7-2467110.pdf?src-supplier=Digi-Key; ComponentLink6URL: https://datasheet.ciiva.com/2467/pyu-r-int-thick-7-2467111.pdf?src-supplier=Digi-Key; ComponentLink6Description: https://datasheet.ciiva.com/2467/pyu-r-int-thick-7-2467111.pdf?src-supplier=Digi-Key; ComponentLink7URL: https://datasheet.ciiva.com/2467/pyu-r-int-thick-7-2467109.pdf?src-supplier=Digi-Key; ComponentLink7Description: https://datasheet.ciiva.com/2467/pyu-r-int-thick-7-2467109.pdf?src-supplier=Digi-Key
R?#1-R?#7 = Res_0402: Part Description: 0 Ohms Jumper Chip Resistor 0201 (0603 Metric) Moisture Resistant Thick Film; Manufacturer: Yageo; Manufacturer Part Number 1: RC0201JR-070RL; Power Rating: 50mW; Tolerance: 5%; Voltage Rating: 25V; ComponentLink1URL: http://www.yageo.com/documents/recent/PYu-RC_Group_51_RoHS_L_7.pdf; ComponentLink1Description: http://www.yageo.com/documents/recent/PYu-RC_Group_51_RoHS_L_7.pdf; Value: 0R; Supplier 1: Digi-Key; Supplier Part Number 1: 311-0.0NCT-ND; Stock 1: 6252381; Pricing 1: 1=0,10000, 10=0,03700, 25=0,02680, 50=0,02020, 100=0,01500, 250=0,01140, 500=0,00912, 1000=0,00672, 5000=0,00482 (USD); RoHS: Yes; Case/Package: 0201; Case Code (Metric): 0603; Case Code (Imperial): 0201; Weight: 6E-06oz; Contact Plating: Tin,Matte; Size Code: 0201; Min Operating Temperature: -55°C; Max Operating Temperature: 125°C; Packaging: Tape and Reel; Resistance: 0R; Package Quantity: 1; Resistor Type: Thick Film; Number of Terminations: 2; Termination: SMD/SMT; Max Power Dissipation: 50mW; Voltage Rating (DC): 25V; Features: Moisture Resistant; Series: RC; Construction: Rectangular; Resistance Tolerance: 5%; Length: 0.024inch; Width: 0.012inch; Height: 0.01inch; Depth: 0.3mm; Radiation Hardening: No; Military Standard: Not; Lead Free: Lead Free; RoHS Compliant: Yes; ComponentLink2URL: https://datasheet.ciiva.com/7672/1563626-7672248.pdf?src-supplier=Element14; ComponentLink2Description: https://datasheet.ciiva.com/7672/1563626-7672248.pdf?src-supplier=Element14; ComponentLink3URL: https://datasheet.ciiva.com/7672/1563626-7672247.pdf?src-supplier=Element14; ComponentLink3Description: https://datasheet.ciiva.com/7672/1563626-7672247.pdf?src-supplier=Element14; ComponentLink4URL: https://datasheet.ciiva.com/7660/1421516-7660808.pdf?src-supplier=Element14; ComponentLink4Description: https://datasheet.ciiva.com/7660/1421516-7660808.pdf?src-supplier=Element14; ComponentLink5URL: https://datasheet.ciiva.com/46391/1421516-46391340.pdf?src-supplier=Element14; ComponentLink5Description: https://datasheet.ciiva.com/46391/1421516-46391340.pdf?src-supplier=Element14
R?#8-R?#15 = Res_0402: Manufacturer: Yageo; Manufacturer Part Number 1: RC0201FR-0747RL; Part Description: 47 Ohms ±1% 0.05W, 1/20W Chip Resistor 0201 (0603 Metric) Moisture Resistant Thick Film; Power Rating: 50mW; Voltage Rating: 25V; Temperature Coefficient: 200ppm/°C; Value: 47R, 1%; Supplier 1: Digi-Key; Supplier Part Number 1: YAG2694CT-ND; Stock 1: 778022; Pricing 1: 1=0,10000, 10=0,03700, 100=0,01530, 1000=0,00685, 2500=0,00595, 5000=0,00491 (USD); RoHS: Yes; Case/Package: 0201; Case Code (Imperial): 0201; Case Code (Metric): 0603; Min Operating Temperature: -55°C; Max Operating Temperature: 125°C; Packaging: Tape and Reel; Resistance: 47R; Tolerance: 1%; Resistor Type: Thick Film; Termination: SMD/SMT; Number of Terminations: 2; Max Power Dissipation: 50mW; Features: Moisture Resistant; Series: RC; Resistance Tolerance: 1%; Length: 0.6mm; Width: 0.3mm; Height: 0.23mm; Reach SVHC Compliant: Yes; RoHS Compliant: Yes; ComponentLink1URL: https://datasheet.ciiva.com/5924/1563626-5924912.pdf?src-supplier=Farnell; ComponentLink1Description: https://datasheet.ciiva.com/5924/1563626-5924912.pdf?src-supplier=Farnell; ComponentLink2URL: https://datasheet.ciiva.com/22661/1563626-22661319.pdf?src-supplier=Element14; ComponentLink2Description: https://datasheet.ciiva.com/22661/1563626-22661319.pdf?src-supplier=Element14
TP1 = TESTPOINT_PAD: Test Point PCB mount Miniature White